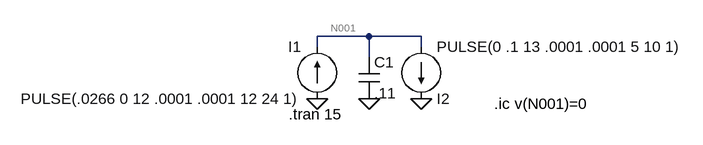
[diagram p0: schematic Draft1.asc]
Draft1.asc, the LTspice schematic file:
Version 4
SHEET 1 880 680
WIRE 128 96 48 96
WIRE 208 96 128 96
WIRE 48 112 48 96
WIRE 208 112 208 96
WIRE 128 128 128 96
FLAG 128 192 0
FLAG 48 192 0
FLAG 208 192 0
SYMBOL cap 112 128 R0
SYMATTR InstName C1
SYMATTR Value .11
SYMBOL current 48 192 R180
WINDOW 0 24 80 Left 2
WINDOW 3 24 0 Left 2
WINDOW 123 0 0 Left 0
WINDOW 39 0 0 Left 0
SYMATTR InstName I1
SYMATTR Value PULSE(.0266 0 12 .0001 .0001 12 24 1)
SYMBOL current 208 112 R0
WINDOW 0 24 80 Left 2
WINDOW 3 24 0 Left 2
WINDOW 123 0 0 Left 0
WINDOW 39 0 0 Left 0
SYMATTR InstName I2
SYMATTR Value PULSE(0 .1 13 .0001 .0001 5 10 1)
TEXT 4 216 Left 2 !.tran 15
TEXT 320 200 Left 2 !.ic v(N001)=0

The netlist it stands for:
* Draft1.asc
C1 N001 0 .11
I1 0 N001 PULSE(.0266 0 12 .0001 .0001 12 24 1)
I2 N001 0 PULSE(0 .1 13 .0001 .0001 5 10 1)
.tran 15
.ic v(N001)=0
.backanno
.end